# EasyEDA Pro project PCB.epro, board PCB1_3
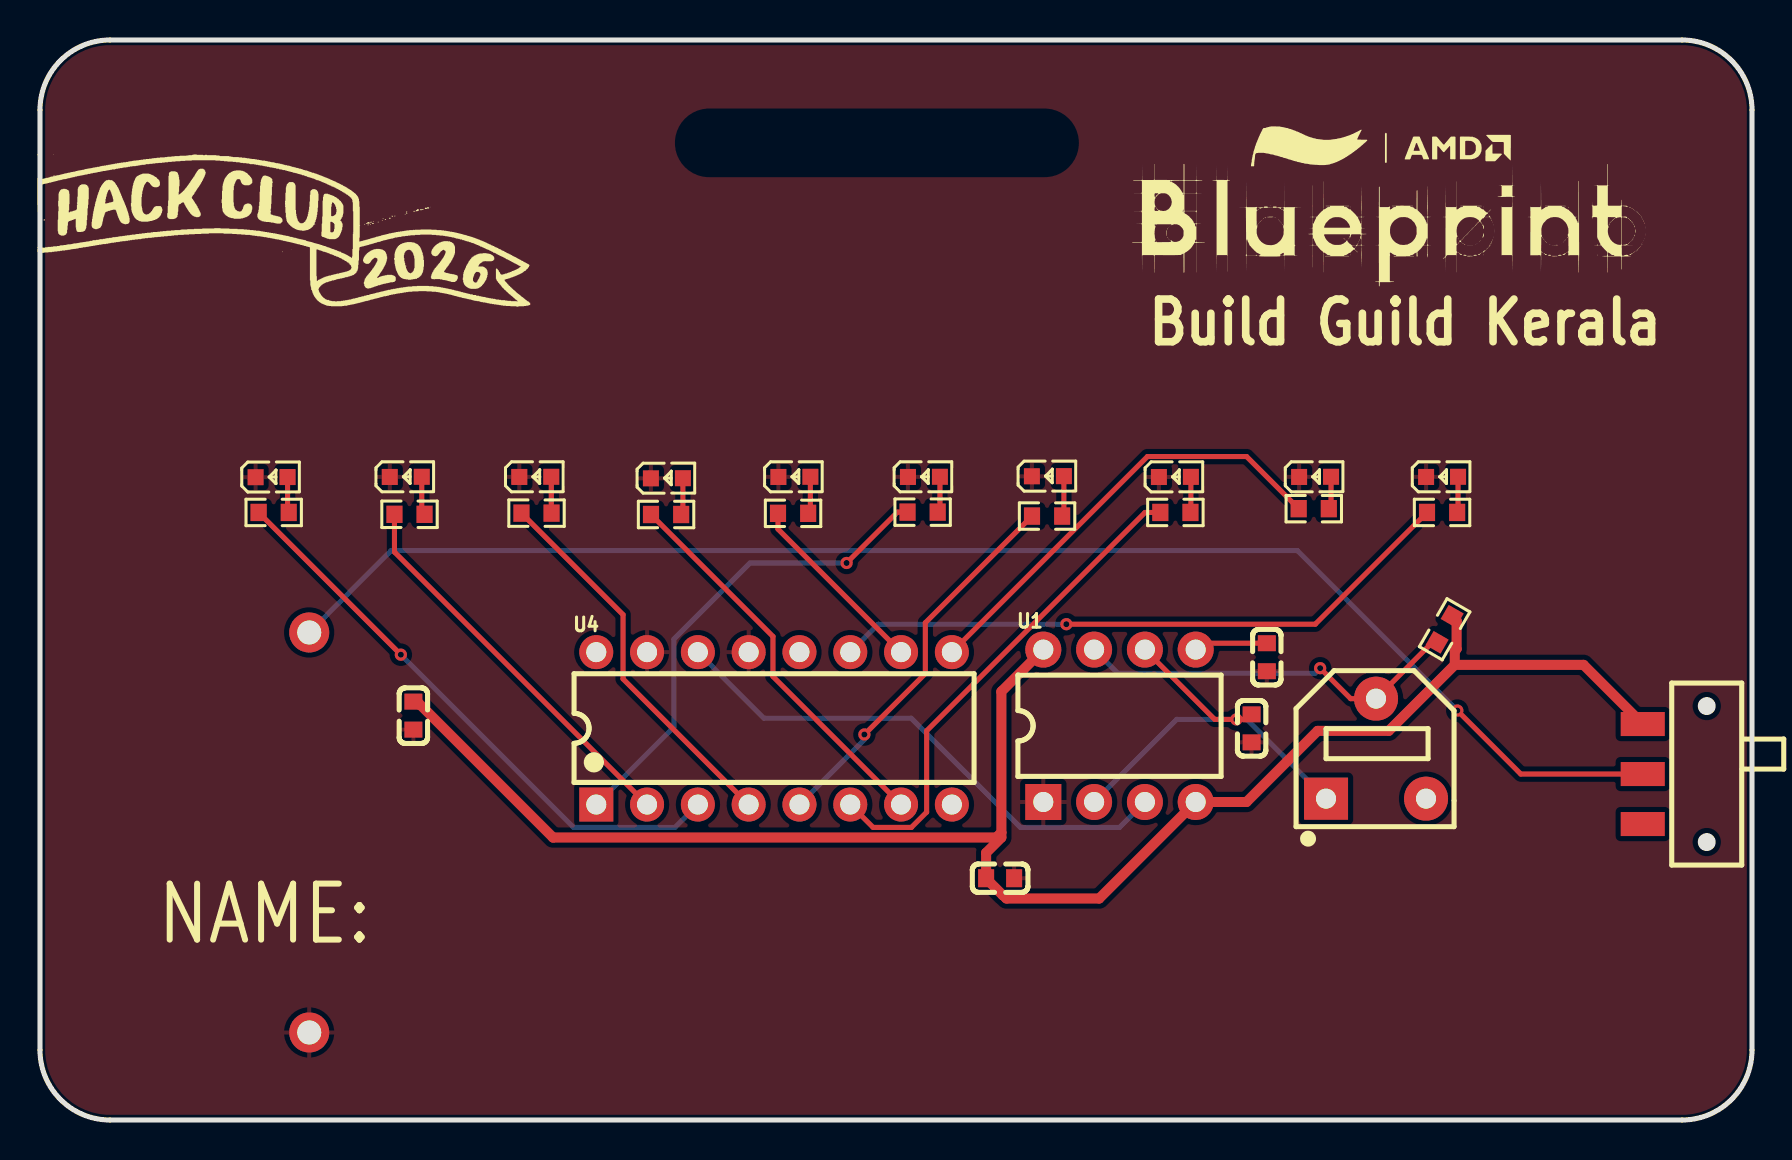
[diagram p11: board, top side]
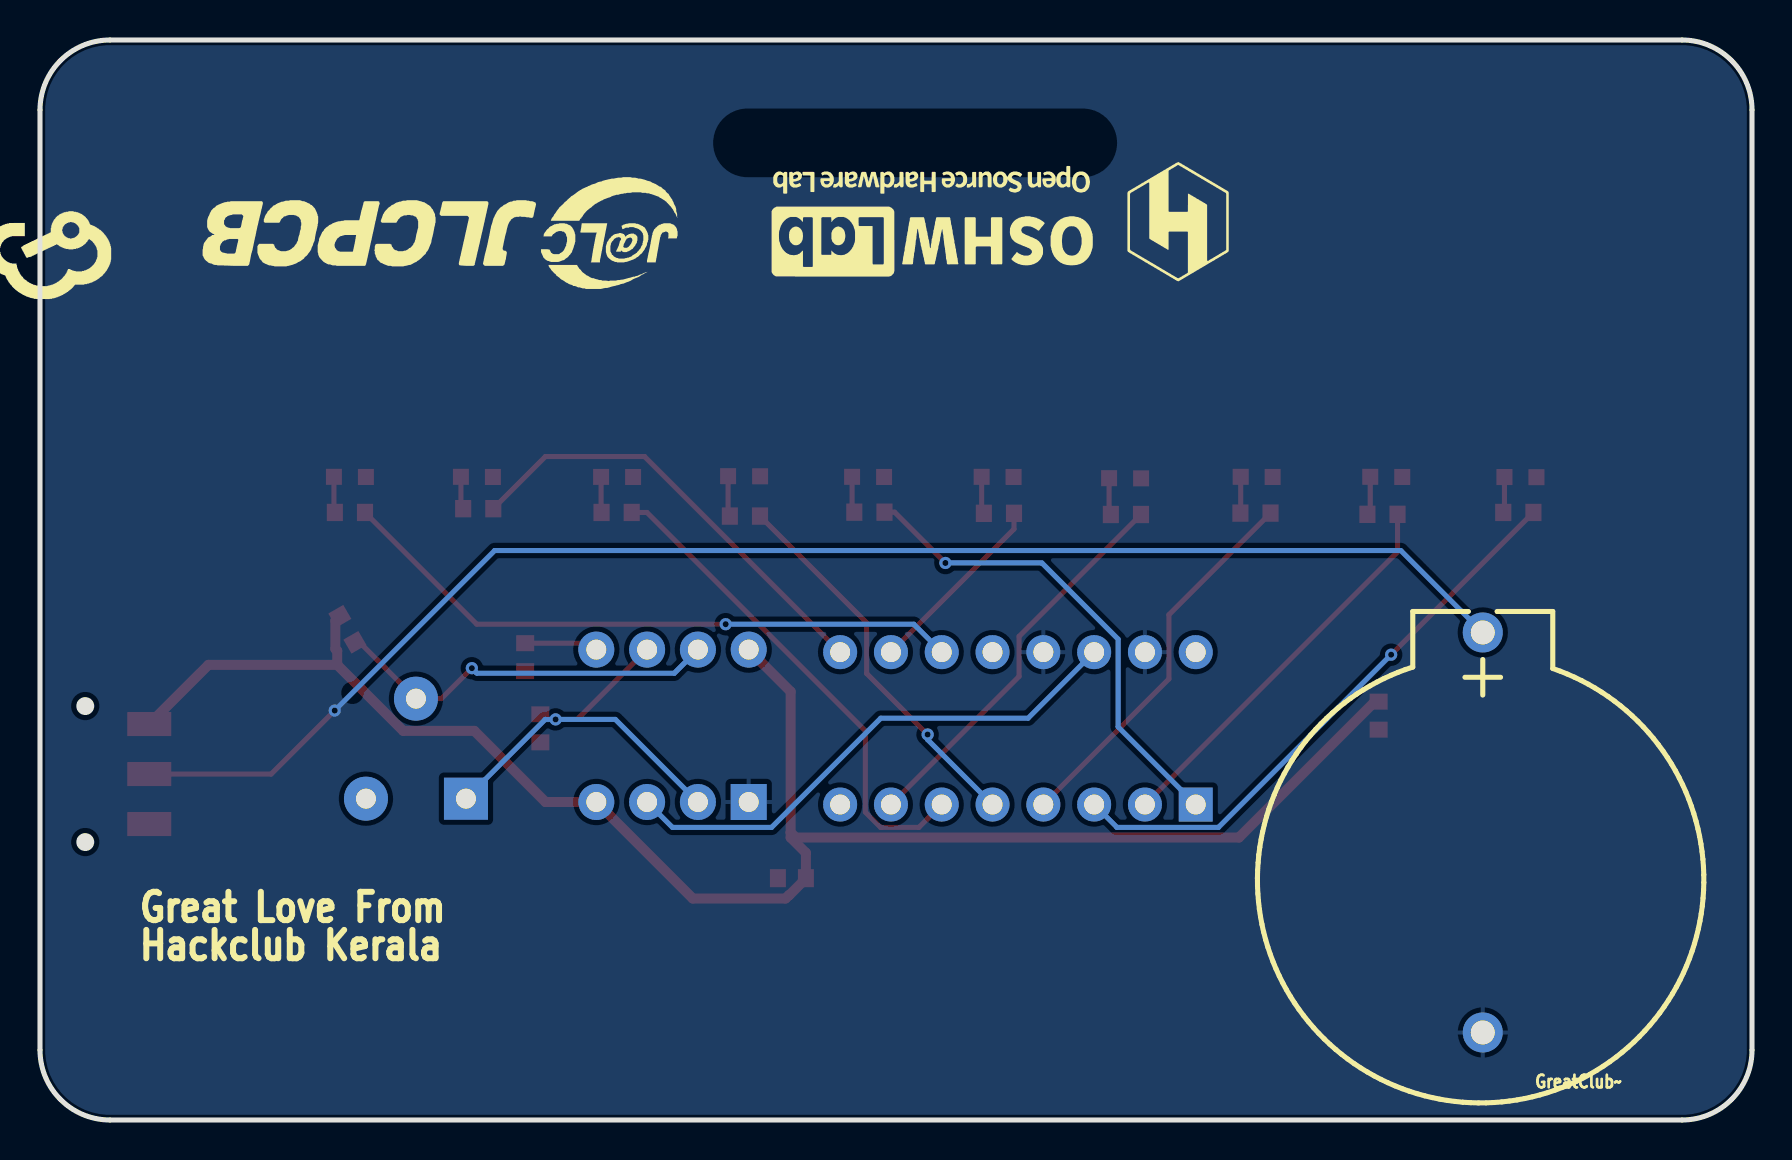
[diagram p12: board, bottom side, seen from below]

Outline 85.6 x 54 mm; copper layers: Top Layer, Bottom Layer. Coordinates in mm from the lower left corner of the outline.
Outline path: 0,50.5 0,3.5 arc(1.03,1.03) 3.5,0 82.1,0 arc(84.57,1.03) 85.6,3.5 85.6,50.5 arc(84.57,52.97) 82.1,54 3.5,54 arc(1.03,52.97) 0,50.5
Stack: Top Layer 0.035mm / Dielectric1 1.51mm FR4 er 4.5 / Bottom Layer 0.035mm

## Design rules (mm)
template: JLCPCB Capability(Two Layers Board)
spacing copperThickness1oz (default): track to track 0.102, other pairs 0.152 to 0.3
spacing copperThickness2oz: track to track 0.203, other pairs 0.152 to 0.3
track width copperThickness1oz (default): min 0.127, default 0.254, max 2.54
track width copperThickness2oz: min 0.203, default 0.254, max 2.54
differential pair differentialPair (default): width min 0.127, default 0.254, max 2.54; gap min 0.152, default 0.152
via viaSize (default): diameter min 0.5, default 0.61, max 10; hole min 0.3, default 0.305, max 6.3

## Placement (name value [footprint] x y rotation side)
BAT1  KH-CR2032-2-1  [BAT-TH_KH-CR2032-2-1]  13.46 14.38 90 bottom
C1  10uF  [C0603]  60.58 19.58 270 top
C2  100nF  [C0603]  61.34 23.14 270 top
C3  100nF  [C0603]  48.01 12.09 0 top
C4  100nF  [C0603]  18.67 20.22 270 top
LED1  YLED0603Y  [LED0603-RD-1]  11.58 32.14 0 top
LED2  YLED0603Y  [LED0603-RD-1]  18.29 32.16 0 top
LED3  YLED0603Y  [LED0603-RD-1]  24.76 32.16 0 top
LED4  YLED0603Y  [LED0603-RD-1]  31.34 32.09 0 top
LED5  YLED0603Y  [LED0603-RD-1]  37.72 32.16 0 top
LED6  YLED0603Y  [LED0603-RD-1]  44.2 32.16 0 top
LED7  YLED0603Y  [LED0603-RD-1]  50.4 32.19 0 top
LED8  YLED0603Y  [LED0603-RD-1]  56.75 32.15 0 top
LED9  YLED0603Y  [LED0603-RD-1]  63.75 32.16 0 top
LED10  YLED0603Y  [LED0603-RD-1]  70.1 32.16 0 top
R1  10kΩ  [R0603]  70.23 24.54 60 top
R2  470Ω  [R0603]  18.48 30.28 0 top
R3  470Ω  [R0603]  24.83 30.34 0 top
R4  470Ω  [R0603]  31.3 30.28 0 top
R5  470Ω  [R0603]  37.65 30.33 0 top
R6  470Ω  [R0603]  44.13 30.39 0 top
R7  470Ω  [R0603]  50.35 30.2 0 top
R8  470Ω  [R0603]  56.77 30.38 0 top
R9  470Ω  [R0603]  63.69 30.57 0 top
R10  470Ω  [R0603]  70.1 30.38 0 top
R11  470Ω  [R0603]  11.68 30.38 0 top
SW1  MST-12D18G2 SMD Slide Switch  [SW-SMD_3P-L9.1-W3.5-P2.50_MST-12D18G2]  80.14 17.3 270 top
U1  TLC555CP  [DIP-8_L9.7-W6.4-P2.54-LS7.6-BL]  53.97 19.71 0 top
U2  100kΩ  [RES-ADJ-SMD_RM065-V1]  66.8 18.57 0 top
U4  CD4017BED  [PDIP-16_L19.7-W6.6-P2.54-LS7.6-BL]  36.7 19.58 0 top

## Footprints (pads in the part's own frame, mm; a bottom-side part is the same pattern mirrored in y, then rotated)
BAT-TH_KH-CR2032-2-1
  round 2 hole 1.2: 1(10,0) 2(-10,0)
C0603
  rect 0.8x0.9 smd: 1(-0.7,0) 2(0.7,0)
DIP-8_L9.7-W6.4-P2.54-LS7.6-BL
  rect 1.8x1.8 hole 1: 1(-3.81,-3.81)
  round 1.8 hole 1: 2(-1.27,-3.81) 3(1.27,-3.81) 4(3.81,-3.81) 5(3.81,3.81) 6(1.27,3.81) 7(-1.27,3.81) 8(-3.81,3.81)
LED0603-RD-1
  rect 0.8x0.8 smd: 1(-0.799,-0.004) 2(0.799,0.004)
PDIP-16_L19.7-W6.6-P2.54-LS7.6-BL
  rect 1.7x1.7 hole 1: 1(-8.89,-3.81)
  round 1.7 hole 1: 2(-6.35,-3.81) 3(-3.81,-3.81) 4(-1.27,-3.81) 5(1.27,-3.81) 6(3.81,-3.81) 7(6.35,-3.81) 8(8.89,-3.81) 9(8.89,3.81) 10(6.35,3.81) 11(3.81,3.81) 12(1.27,3.81) 13(-1.27,3.81) 14(-3.81,3.81) 15(-6.35,3.81) 16(-8.89,3.81)
R0603
  rect 0.806x0.864 smd: 1(-0.753,0) 2(0.753,0)
RES-ADJ-SMD_RM065-V1
  rect 2.2x2.1 hole 1: 1(-2.5,-2.5)
  round 2.2 hole 1: 2(0,2.5) 3(2.5,-2.5)
SW-SMD_3P-L9.1-W3.5-P2.50_MST-12D18G2
  rect 1.2x2.2 smd: 1(-2.5,0) 2(0,0) 3(2.5,0)

## Nets
As in the schematic.

Pads without a net: SW1 3; U2 3; U4 8 12 16

## Via types
v1: diameter 0.61, hole 0.305, Top Layer to Bottom Layer, 7 vias

## Routing (per net, layer and track width the routed paths; a pad name or vN(x,y) marks a point on that pad's centre or on a via; arc(x,y) is an arc through that point)
VCC: length 86.8
  Top Layer w0.5: 48.07,14.38 47.81,14.12 25.65,14.12 18.86,20.92 C4.1 ; 48.07,14.38 48.07,14.12 47.31,13.36 C3.1 47.31,12.07 48.14,11.24 48.16,11.24 48.32,11.07 52.96,11.07 U1.4 60.32,15.9 63.88,19.46 67.44,19.46 70.74,22.76 ; 48.07,14.38 48.07,21.42 U1.8 ; R1.2 70.83,24.96 70.83,23.56 70.74,23.46 70.74,22.76 ; 70.74,22.76 77.18,22.76 SW1.1
1: length 29
  Top Layer w0.254: R11.1 v1(18.04,23.27)
  Bottom Layer w0.254: v1(18.04,23.27) 26.68,14.63 31.75,14.63 U4.3
2: length 19.7
  Top Layer w0.254: 17.72,30.28 17.72,28.4 U4.2
3: length 19.3
  Top Layer w0.254: 24.07,30.34 29.15,25.26 29.15,22.05 U4.4
4: length 19.7
  Top Layer w0.254: R4.1 36.65,24.18 36.65,22.18 U4.7
5: length 9.5
  Top Layer w0.254: R5.1 36.9,29.55 U4.10
6: length 24.2
  Top Layer w0.254: 43.38,30.39 42.87,30.39 v1(40.33,27.85)
  Bottom Layer w0.254: v1(40.33,27.85) 35.5,27.85 31.69,24.04 31.69,19.65 U4.1
7: length 19.2
  Top Layer w0.254: R7.1 44.27,24.86 44.27,22.32 v1(41.22,19.27)
  Bottom Layer w0.254: U4.5 41.22,19.02 v1(41.22,19.27)
8: length 24.9
  Top Layer w0.254: R8.1 55.25,30.38 44.33,19.46 44.33,15.39 43.57,14.63 41.66,14.63 U4.6
9: length 22.5
  Top Layer w0.254: R9.1 60.33,33.17 55.37,33.17 45.59,23.39
10: length 31.7
  Top Layer w0.254: R10.1 63.76,24.79 v1(51.32,24.79)
  Bottom Layer w0.254: U4.11 41.91,24.79 v1(51.32,24.79)
PIN: length 21.8
  Top Layer w0.254: C1.1 60.33,20.03 v1(59.82,20.03) 58.74,20.03 U1.6
  Bottom Layer w0.254: U1.2 56.83,20.03 v1(59.82,20.03) 60.34,20.03 U2.1
$1N11512: length 19.5
  Top Layer w0.254: v1(64.01,22.59) 65.53,21.07 U2.2 69.62,23.88 R1.1
  Bottom Layer w0.254: U1.7 53.89,22.34 63.75,22.34 v1(64.01,22.59)
$1N11976: length 26.5
  Bottom Layer w0.254: U4.14 36.19,20.09 43.56,20.09 49.02,14.63 53.97,14.63 U1.3
$1N14501: length 3.7
  Top Layer w0.254: U1.5 58.1,23.84 C2.1
$1N14987: length 73
  Top Layer w0.254: SW1.2 74.04,17.3 v1(70.87,20.47)
  Bottom Layer w0.254: v1(70.87,20.47) 62.87,28.47 17.56,28.47 BAT1.1
$1N17110: length 1.8
  Top Layer w0.254: LED1.2 12.38,30.44 R11.2
$1N17152: length 1.9
  Top Layer w0.254: LED2.2 19.09,30.43 R2.2
$1N17194: length 1.8
  Top Layer w0.254: R3.2 25.56,30.36 LED3.2
$1N17236: length 1.9
  Top Layer w0.254: LED4.2 32.14,30.36 32.06,30.28
$1N17278: length 1.9
  Top Layer w0.254: R5.2 38.52,30.44 LED5.2
$1N17320: length 1.8
  Top Layer w0.254: LED6.2 45,30.5 R6.2
$1N17362: length 2
  Top Layer w0.254: LED7.2 51.19,30.28 R7.2
$1N17404: length 1.8
  Top Layer w0.254: R8.2 57.54,30.4 LED8.2
$1N17446: length 1.6
  Top Layer w0.254: LED9.2 64.55,30.68 R9.2
$1N17488: length 1.8
  Top Layer w0.254: LED10.2 70.9,30.42 R10.2

## Copper pours and planes (outline as drawn; the poured copper is in the pictures)
GND on Top Layer: -13.21,62 92.71,62 92.71,-5.94 -13.21,-5.94
GND on Bottom Layer: -20.7,68.1 88.39,68.1 88.39,-1.88 -20.7,-1.88

## Text on the board
Bottom Silkscreen Layer: GreatClub~ | Great Love From | Hackclub Kerala
Top Silkscreen Layer: Build Guild Kerala | NAME:
